# Altium project AirQuality_PRJ.PrjPcb
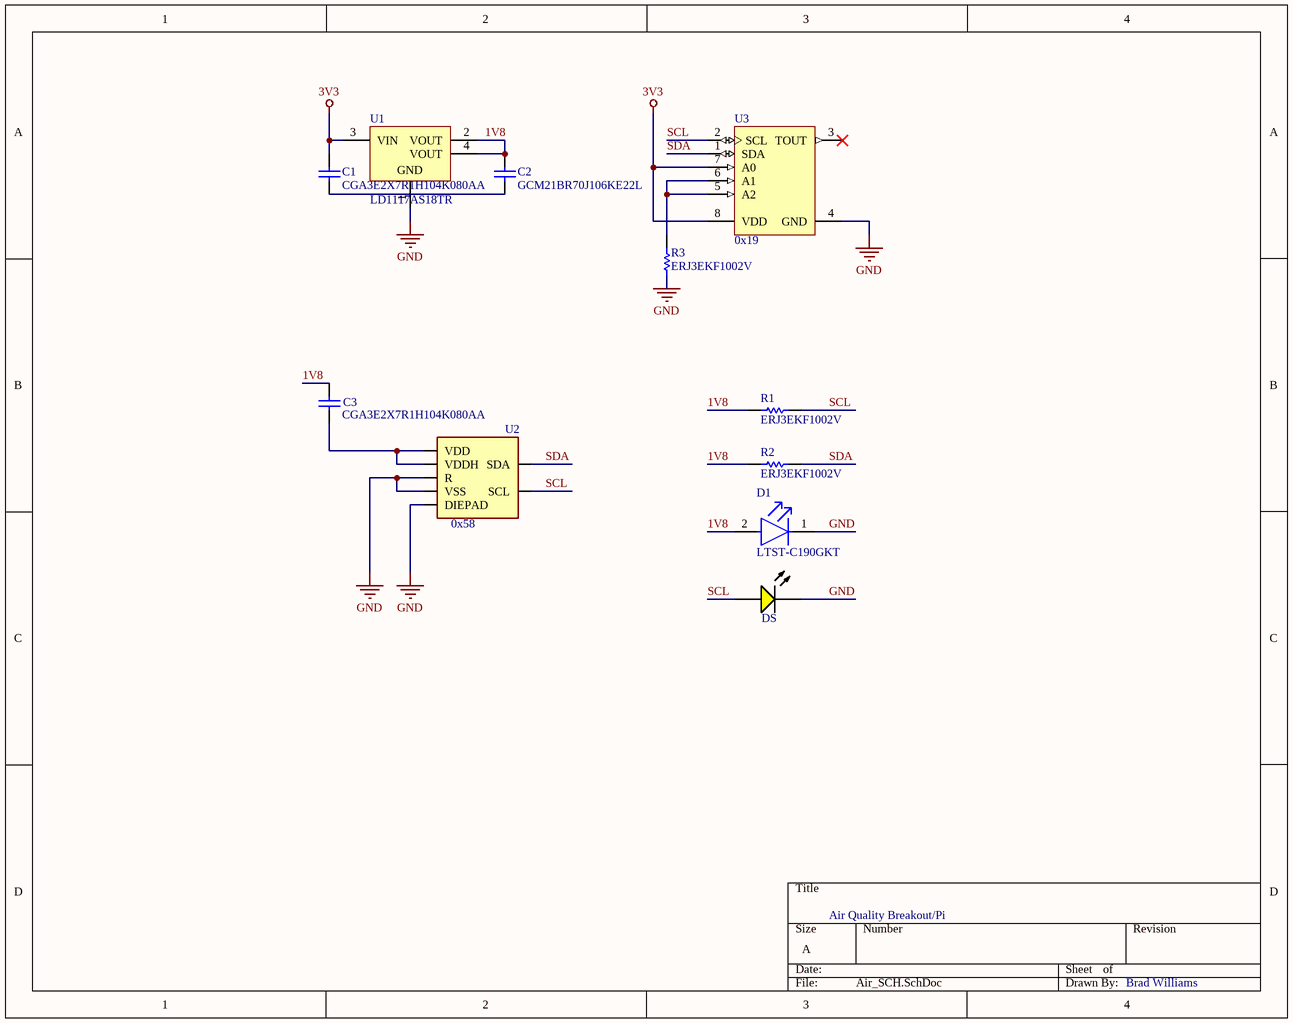
[diagram p0: Air_SCH.SchDoc]
1 sheet, 11 parts. Net scope: global (net labels, ports and power ports of the same name join across sheets).
Board file: Air_PCB.PcbDoc

## Sheet Air_SCH.SchDoc
size A

### Parts
C1  CGA3E2X7R1H104K080AA  [CAPC1608X90X20LL10]
C2  GCM21BR70J106KE22L  [CAPC2013X140X45LL15T25]
C3  CGA3E2X7R1H104K080AA  [CAPC1608X90X20LL10]
D1  LTST-C190GKT  [FP-LTST-C190GKT-MFG]
DS  HSMY-C190  [AVAG-HSMX-C190_V]  (value not drawn)
R1  ERJ3EKF1002V  [RESC1609X55X30LL15T15]
R2  ERJ3EKF1002V  [RESC1609X55X30LL15T15]
R3  ERJ3EKF1002V  [RESC1609X55X30LL15T15]
U1  LD1117AS18TR  [SOT-223_L]
U2  0x58  [SGP30]
U3  0x19  [MAXM-W8+2_L]

### Nets
3V3: C1.2 U1.3(VIN) U3.7(A0) U3.8(VDD)
GND: D1.1(C) DS.2(K) R3.2 U1.1(GND) U2.2(VSS) U2.4(R) U2.DIEPAD U3.4(GND)
1V8: C2.2 C3.2 D1.2(A) R1.2 R2.1 U1.2(VOUT) U1.4(VOUT)
SCL: DS.1(A) R1.1 U2.6(SCL) U3.2(SCL)
SDA: R2.2 U2.3(SDA) U3.1(SDA)
NetC1_1: C1.1 C2.1
NetC3_1: C3.1 U2.1(VDD) U2.5(VDDH)
NetR3_1: R3.1 U3.5(A2) U3.6(A1)

Not connected (* = marked no-connect by the designer): U3 3(TOUT)*

### Notes on the sheet
- Air Quality Breakout/Pi
- Brad Williams

### Library data of the parts
C1 C3 = CMP-2000-07546-1: Chip Capacitor, 0.1 uF, +/- 10%, 50 V, -55 to 125 degC, 0603 (1608 Metric), RoHS, Tape and Reel; Manufacturer: TDK; Capacitance: 100nF; Voltage: 50V; Dielectric: X7R; Package Reference: 603; Radiation Hardening: No; Composition: Ceramic; Datasheet URL: https://product.tdk.com/info/en/catalog/datasheets/mlcc_automotive_general_en.pdf; Mounting Technology: SurfaceMount; Datasheet Version: 12/2014; Width: 0.8mm; Length: 1.6mm; Tolerance: 10%; Case Code (Imperial): 0603; RoHSCompliant: True; Min Operating Temperature: -55degC; Package Description: 2-Pin Surface Mount Device, Body 1.6 x 0.8 mm; Packaging: TapeandReel; Package Quantity: 1; Voltage Rating: 50V; Mount: SurfaceMount; Lead Free: LeadFree; Depth: 0.8mm; Termination: SMD/SMT; Case Code (Metric): 1608; Thickness: 0.035inch; Height: 0.8mm; Weight: 7.1E-05oz; Voltage Rating (DC): 50V; REACH SVHC: NoSVHC; Manufacturer URL: http://www.tdk.com/; Case/Package: 0603; Max Operating Temperature: 125degC
C2 = CMP-2007-03335-1: Manufacturer: Murata; Part Number: GCM21BR70J106KE22L
D1 = CMP-22017-000018-1: LED GREEN CLEAR CHIP SMD; Dominant Wavelength: 569nm; Reverse Voltage: 5V; Lens Color: Colorless; Viewing Angle: 130°; Voltage: 2V; Forward Current: 30mA; Power Dissipation: 100mW; Luminous Intensity: 6mcd; Number of LEDs: 1; Forward Voltage: 2.1V; Wavelength: 565nm; Test Current: 10mA; Min Operating Temperature: -55°C; Lens Style: Clear; Mount: Surface Mount; Width: 0.8mm; Packaging: Tape and Reel; Lens Transparency: Clear; Case Code (Metric): 1608; Depth: 0.8mm; Case Code (Imperial): 0603; Case/Package: 0603; Number of Pins: 2; Max Operating Temperature: 85°C; Lead Free: Lead Free; Number of Elements: 1; Length: 1.6mm; Height: 0.8mm; Package Quantity: 1; Power Rating: 100mW; Radiation Hardening: No; Illumination Color: Green; Color: Green
DS = CMP-1744-00003-1: LED Uni-Color Yellow, 65 mW, 20 mA, -40 to 85 degC, 2-Pin SMD, RoHS, Tape and Reel; Tolerance: 1%; Voltage Rating: 50 V; Power Rating: 100 mW; Case\Package: 0603; Resistance: 390 Ohm; Min Operating Temperature: -55 degC; Length: 1.6 mm; ComponentLink3Description: Package Specification; Mount: Surface Mount; PackageReference: HSMX-C190; ComponentLink2Description: Datasheet; DatasheetVersion: Mar-12; Case Code (Metric): 1608; Pins: 2; Package Quantity: 5000; ComponentLink2URL: http://docs.avagotech.com/docs/AV02-0551EN; ComponentLink1Description: Manufacturer URL; RoHSCompliant: true; Packaging: Tape and Reel; PackageDescription: 2-Pin Surface Mount Device, Body 1.6 x 0.8 mm, Height 0.9 mm; REACH SVHC: No SVHC; ComponentLink3URL: http://www.fairchildsemi.com/dwg/MA/MA03D.pdf; Voltage Rating (DC): 50 V; Width: 0.8 mm; ComponentLink1URL: http://www.avagotech.com/; Max Operating Temperature: 155 degC; Case Code (Imperial): 0603; Height: 0.45 mm
R1-R3 = CMP-2000-07452-1: Chip Resistor, 10 KOhm, +/- 1%, 0.1 W, -55 to 155 degC, 0603 (1608 Metric), RoHS, Tape and Reel; Manufacturer: Panasonic; Voltage Rating: 75V; Case\/Package: 0603; Power Rating: 100mW; Resistance: 10KOhm; Temperature Coefficient: 100ppm\/degreesC; Number of Pins: 2; Package Reference: 603; Depth: 0.8mm; Mount: SurfaceMount; Package Description: 2-Pin Surface Mount Device, Body 1.6 x 0.85 mm; Datasheet Version: 02/2017; Length: 1.6mm; Lead Free: LeadFree; Height: 0.45mm; Number of Terminations: 2; Max Power Dissipation: 100mW; Min Operating Temperature: -55degC; Datasheet URL: https://industrial.panasonic.com/cdbs/www-data/pdf/RDA0000/AOA0000C304.pdf; Termination: SMD/SMT; Case Code (Metric): 1608; Case Code (Imperial): 0603; Tolerance: 1%; Max Operating Temperature: 155degC; RoHSCompliant: true; Voltage Rating (DC): 75V; Radiation Hardening: No; Packaging: TapeandReel; Composition: ThickFilm; Mounting Technology: SurfaceMount; Manufacturer URL: http://www.panasonic.com/; Width: 0.031inch; REACH SVHC: NoSVHC; Contact Plating: Tin; Military Standard: Not; Package Quantity: 1
U1 = CMP-0244-00319-1: 1A, Low Drop Positive Voltage Regulator, 1.8V, 4-Pin SOT-223, Tape and Reel; DatasheetVersion: 2/12/2011; ComponentLink2URL: http://www.st.com/internet/com/TECHNICAL_RESOURCES/TECHNICAL_LITERATURE/DATASHEET/CD00002116.pdf; ComponentLink1Description: Manufacturer URL; ComponentLink1URL: http://www.st.com; PackageReference: SOT-223; PackageVersion: 2010; PackageDescription: 4-Pin SOT-223 Package, 6.5 x 3.5 mm Body, 2.3 mm Pitch, 7 mm Lead Span; ComponentLink2Description: Datasheet
U2 = CMP-011-0000-1: AIR QUALITY GAS SENSOR FOR VOC'S; MF: Sensirion AG; Package: None; SnapEDA_Link: https://www.snapeda.com/parts/SGP30/Sensirion%20AG/view-part/1413307/?ref=snap; Component Type: Standard; Pin Count: 7; Design Item ID: SGP30; MP: SGP30; Price: None; Source: SnapEDAsch.SchLib; Availability: Unavailable; Value: *
U3 = CMP-0253-01131-1: 2-wire 0.5 degC Accurate Temperature Sensor and Thermostat, 9 to 12 Bits Temperature Resolution, -55 to 125 degC, 8-Pin SOIC (W8+2), Pb-Free; Generic Part Number: DS1621; PartNumber: DS1621V+; Multi Droppable: Yes; Interface: 2-Wire/I2C/SMBus; Parasite Pwr.: No; Functions: Single Temperature Alarm; PackageReference: W8+2; ComponentLink1Description: Manufacturer URL; ComponentLink2URL: http://datasheets.maximintegrated.com/en/ds/DS1621.pdf; ComponentLink2Description: Datasheet; ComponentLink3URL: http://pdfserv.maximintegrated.com/package_dwgs/21-0262.PDF; PackageVersion: Rev. B, 01/2010; DatasheetVersion: Rev. 3; ComponentLink3Description: Package Specification; PackageDescription: 8-Pin Small-Outline IC, Body 5.285 x 5.31 mm, Pitch 1.27 mm; ComponentLink1URL: http://www.maximintegrated.com/; Mounting Technology: Surface Mount